# Altium schematic sheet 发送端V02.SchDoc
size A3
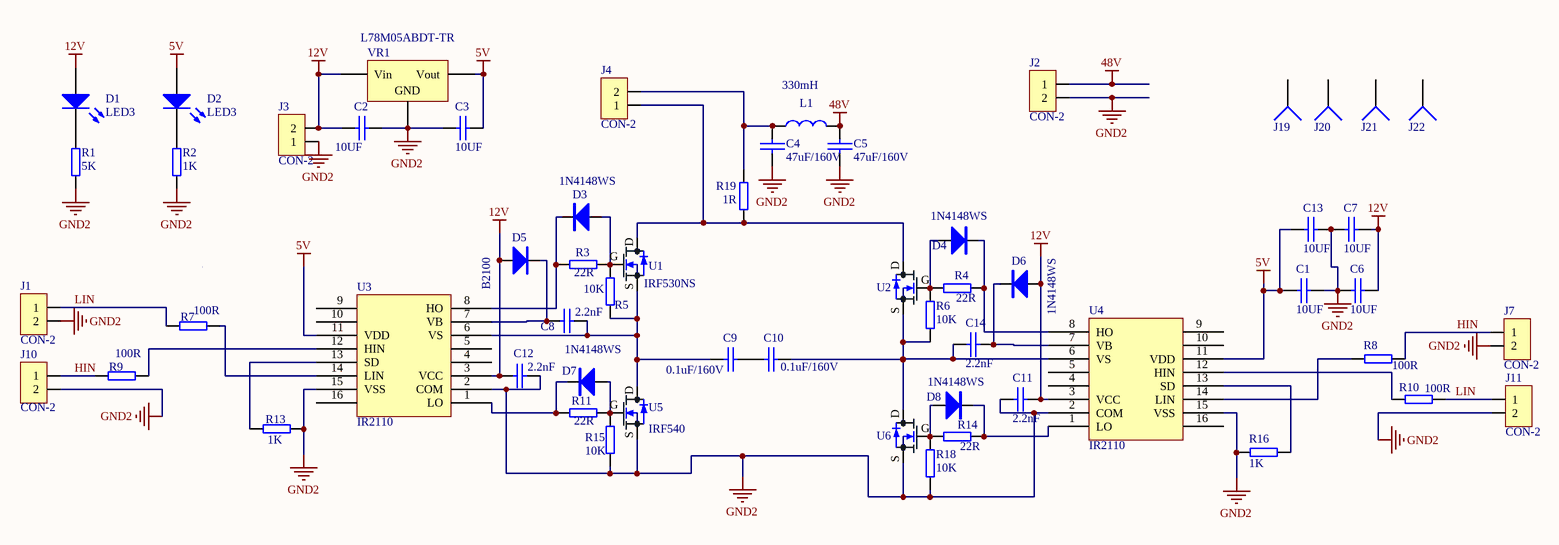
[diagram p0: 发送端V02.SchDoc]

## Parts
C1  10UF  [1206_C]
C2  10UF  [1206_C]
C3  10UF  [1206_C]
C4  47uF/160V  [C3618]
C5  47uF/160V  [C3618]
C6  10UF  [1206_C]
C7  10UF  [1206_C]
C8  2.2nF  [1206_C]
C9  0.1uF/160V  [DSMC82]
C10  0.1uF/160V  [DSMC82]
C11  2.2nF  [1206_C]
C12  2.2nF  [1206_C]
C13  10UF  [1206_C]
C14  2.2nF  [1206_C]
D1  LED3  [1206_R]
D2  LED3  [1206_R]
D3  1N4148WS  [SOD-123]
D4  1N4148WS  [SOD-123]
D5  B2100  [1206_R]
D6  1N4148WS  [1206_R]
D7  1N4148WS  [SOD-123]
D8  1N4148WS  [SOD-123]
J1  CON-2  [GPSPIN]
J2  CON-2  [F396P2-1]
J3  CON-2  [F396P2-1]
J4  CON-2  [HDR1X2]
J7  CON-2  [GPSPIN]
J10  CON-2  [GPSPIN]
J11  CON-2  [GPSPIN]
J19  Socket  [M3]  (value not drawn)
J20  Socket  [M3]  (value not drawn)
J21  Socket  [M3]  (value not drawn)
J22  Socket  [M3]  (value not drawn)
L1  330mH  [H3.3]
R1  5K  [1206_R]
R2  1K  [1206_R]
R3  22R  [1206_R]
R4  22R  [1206_R]
R5  10K  [1206_R]
R6  10K  [1206_R]
R7  100R  [1206_R]
R8  100R  [1206_R]
R9  100R  [1206_R]
R10  100R  [1206_R]
R11  22R  [1206_R]
R13  1K  [1206_R]
R14  22R  [1206_R]
R15  10K  [1206_R]
R16  1K  [1206_R]
R18  10K  [1206_R]
R19  1R  [R10MR10MM1D5]
U1  IRF530NS  [TO-220]
U2  NMOS  [TO-220]  (value not drawn)
U3  IR2110  [SOIC-16_300mil]
U4  IR2110  [SOIC-16_300mil]
U5  IRF540  [TO-220]
U6  NMOS  [TO-220]  (value not drawn)
VR1  L78M05ABDT-TR  [TO-252-2-180]

## Nets
5V: C1.1 C3.1 C13.1 D2.1(A) U3.11(VDD) U4.11(VDD) VR1.3(Vout)
12V: C2.2 C6.2 C7.2 C11.2 C12.2 D1.1(A) D5.1(A) D6.1(A) J3.2 U3.3(VCC) U4.3(VCC) VR1.1(Vin)
48V: C5.1 J2.1 L1.1
GND2: C1.2 C2.1 C3.2 C4.2 C5.2 C6.1 C7.1 C11.1 C12.1 C13.2 J1.2 J2.2 J3.1 J7.2 J10.2 J11.2 R1.1 R2.1 R13.2 R15.1 R16.2 R18.1 U3.2(COM) U3.15(VSS) U4.2(COM) U4.15(VSS) U5.S U6.S VR1.2(GND)
HIN: J7.1 J10.1 R8.1 R9.1
LIN: J1.1 J11.1 R7.1 R10.1
NetC4_1: C4.1 J4.2 L1.2 R19.2
NetC8_1: C8.1 C9.1 R5.1 U1.S U3.6(VS) U5.D
NetC8_2: C8.2 D5.2(K) U3.7(VB)
NetC9_2: C9.2 C10.1
NetC10_2: C10.2 C14.1 R6.1 U2.S U4.6(VS) U6.D
NetC14_2: C14.2 D6.2(K) U4.7(VB)
NetD1_2: D1.2(K) R1.2
NetD2_2: D2.2(K) R2.2
NetD3_1: D3.1(A) R3.2 R5.2 U1.G
NetD3_2: D3.2(K) R3.1 U3.8(HO)
NetD4_1: D4.1(A) R4.2 R6.2 U2.G
NetD4_2: D4.2(K) R4.1 U4.8(HO)
NetD7_1: D7.1(A) R11.2 R15.2 U5.G
NetD7_2: D7.2(K) R11.1 U3.1(LO)
NetD8_1: D8.1(A) R14.2 R18.2 U6.G
NetD8_2: D8.2(K) R14.1 U4.1(LO)
NetJ4_1: J4.1 R19.1 U1.D U2.D
NetR7_2: R7.2 U3.14(LIN)
NetR8_2: R8.2 U4.14(LIN)
NetR9_2: R9.2 U3.12(HIN)
NetR10_2: R10.2 U4.12(HIN)
NetR13_1: R13.1 U3.13(SD)
NetR16_1: R16.1 U4.13(SD)

Not connected (* = marked no-connect by the designer): J19 1; J20 1; J21 1; J22 1; U3 4 5 9 10 16; U4 4 5 9 10 16

## Library data of the parts
C1-C14 = CAP
D1 D2 = LED3: Typical BLUE SiC LED; Published: 8-Jun-2000; LatestRevisionDate: 17-Dec-2003; LatestRevisionNote: PCB Footprint replaced.; DatasheetVersion: 16-Apr-2002; PackageVersion: 16-Apr-2002; PackageReference: 3.5X2.8X1.9; Publisher: Altium Limited; PackageDescription: SM LED; 2 C-Bend Leads; Body 3.5 x 2.8 x 1.9 mm, inc leads (LxWxH typ)
D3-D8 = 1N4148: 1N4148WS IN4148 0805 SOD323 丝印T4 贴片开关二极管
L1 = INL: CD75--2.2mH 222M 贴片功率电感绕线功率电感 7*7.8*5mm
R1-R11 R13-R16 R18 R19 = RES
U1 U5 = NMOS
VR1 = TO-252-2 L78M05ABDT-TR: 低压差线性稳压(LDO); ComponentLink1Description: 供应商链接; ComponentLink1URL: http://www.szlcsc.com/product/details_59107.html; Package: TO-252-2; Supplier: LC; SuppliersPartNumber: C58069
J19-J22 = Socket: LatestRevisionDate: 17-Jul-2002; LatestRevisionNote: Re-released for DXP Platform.; Publisher: Altium Limited